# Altium schematic sheet MacroQMK.SchDoc
size A4; SheetNumber: 1; SheetTotal: 1
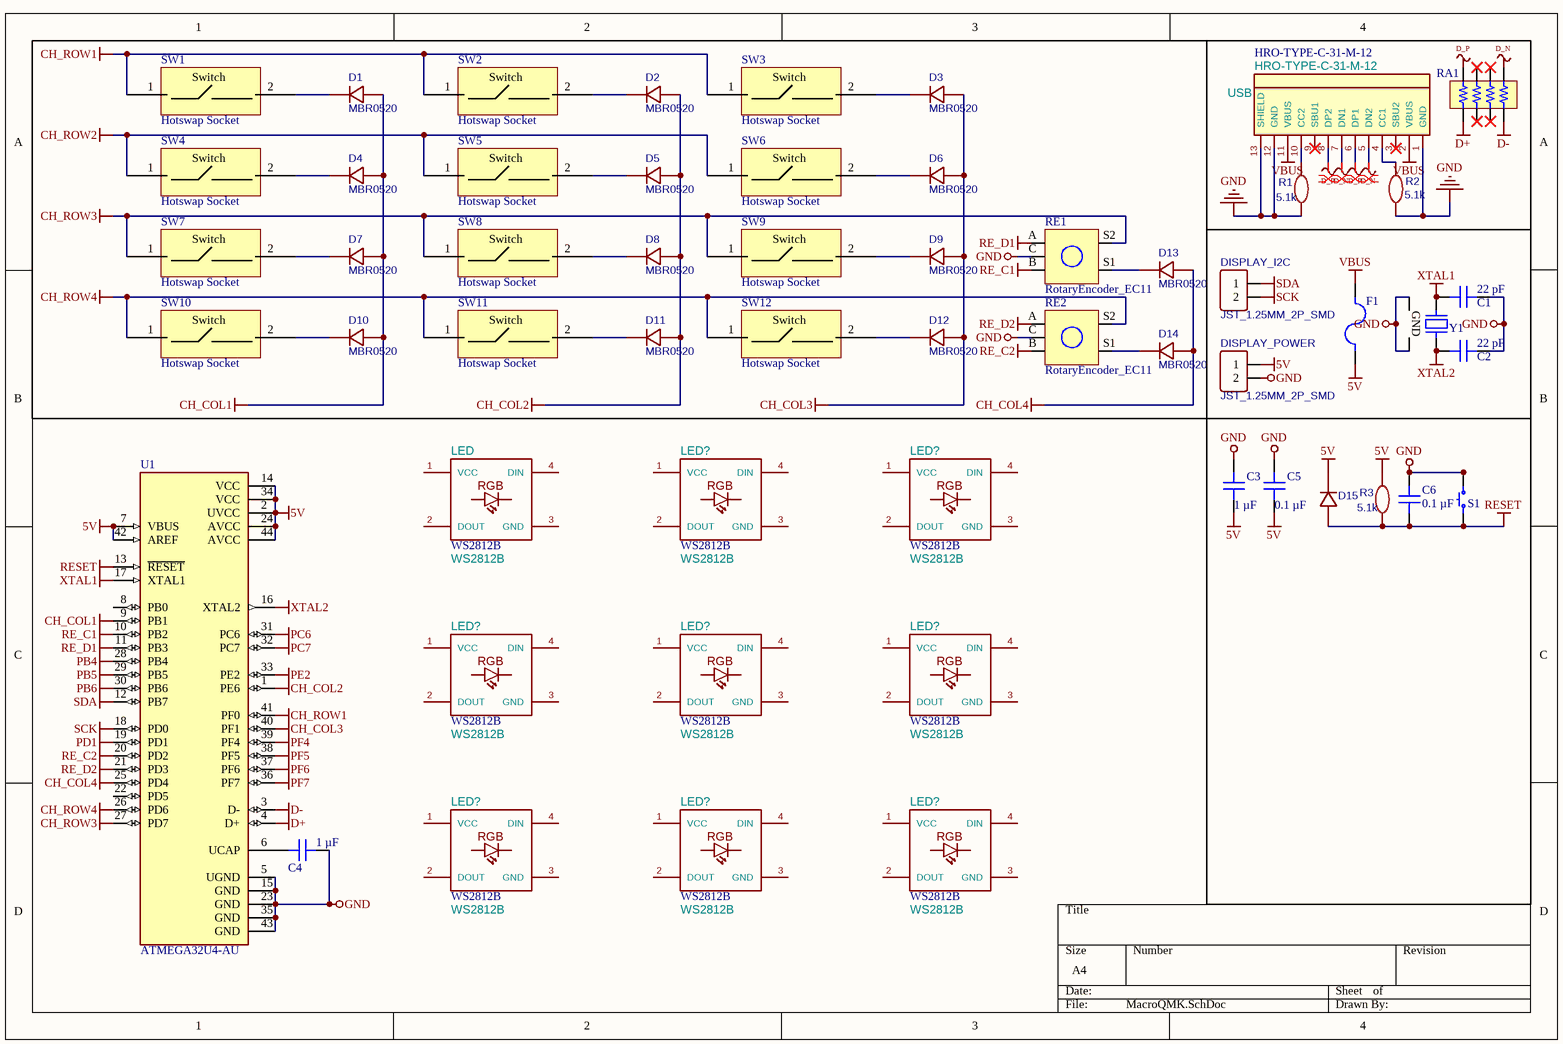
[diagram p0: MacroQMK.SchDoc]

## Parts
(Parts that share a designator on the sheet are numbered #1, #2 ... from top to bottom, then left to right.)
C1  22 pF  [CAP 0402_1005]
C2  22 pF  [CAP 0402_1005]
C3  1 µF  [CAP 0402_1005]
C4  1 µF  [CAP 0402_1005]
C5  0.1 µF  [CAP 0402_1005]
C6  0.1 µF  [CAP 0402_1005]
D1  MBR0520  [SOD123F]
D2  MBR0520  [SOD123F]
D3  MBR0520  [SOD123F]
D4  MBR0520  [SOD123F]
D5  MBR0520  [SOD123F]
D6  MBR0520  [SOD123F]
D7  MBR0520  [SOD123F]
D8  MBR0520  [SOD123F]
D9  MBR0520  [SOD123F]
D10  MBR0520  [SOD123F]
D11  MBR0520  [SOD123F]
D12  MBR0520  [SOD123F]
D13  MBR0520  [SOD123F]
D14  MBR0520  [SOD123F]
D15  MBR0520  [SOD123F]  (value not drawn)
DISPLAY_I2C  JST_1.25MM_2P_SMD  [JST_1.25MM_2P_SMD]
DISPLAY_POWER  JST_1.25MM_2P_SMD  [JST_1.25MM_2P_SMD]
F1  MF-MSMF050/60-2  [FUSER_MF-MSMF020/60-2]  (value not drawn)
LED  WS2812B  [WS2812B]
LED?#1  WS2812B  [WS2812B]
LED?#2  WS2812B  [WS2812B]
LED?#3  WS2812B  [WS2812B]
LED?#4  WS2812B  [WS2812B]
LED?#5  WS2812B  [WS2812B]
LED?#6  WS2812B  [WS2812B]
LED?#7  WS2812B  [WS2812B]
LED?#8  WS2812B  [WS2812B]
R1  5.1k  [RES 0402_1005]
R2  5.1k  [RES 0402_1005]
R3  5.1k  [RES 0402_1005]
RA1  741C083220JP  [RESNET 0804-8 CONCAVE]  (value not drawn)
RE1  RotaryEncoder_EC11  [RotaryEncoder_EC11]
RE2  RotaryEncoder_EC11  [RotaryEncoder_EC11]
S1  EVQ-Q2Y03W  [PANASONIC EVQQ2]  (value not drawn)
SW1  Hotswap Socket  [MX-Hotswap-Template]
SW2  Hotswap Socket  [MX-Hotswap-Template]
SW3  Hotswap Socket  [MX-Hotswap-Template]
SW4  Hotswap Socket  [MX-Hotswap-Template]
SW5  Hotswap Socket  [MX-Hotswap-Template]
SW6  Hotswap Socket  [MX-Hotswap-Template]
SW7  Hotswap Socket  [MX-Hotswap-Template]
SW8  Hotswap Socket  [MX-Hotswap-Template]
SW9  Hotswap Socket  [MX-Hotswap-Template]
SW10  Hotswap Socket  [MX-Hotswap-Template]
SW11  Hotswap Socket  [MX-Hotswap-Template]
SW12  Hotswap Socket  [MX-Hotswap-Template]
U1  ATMEGA32U4-AU  [QFP80P1200X1200X120-44N]
USB  HRO-TYPE-C-31-M-12  [HRO-TYPE-C-31-M-12]
Y1  16MHz  [NDK NX3225SA]  (value not drawn)

## Nets
5V: C3.1 C5.1 D15.1 DISPLAY_POWER.1 F1.1 R3.2 U1.2(UVCC) U1.7(VBUS) U1.14(VCC) U1.24(AVCC) U1.34(VCC) U1.42(AREF) U1.44(AVCC)
CH_COL1: D1.2 D4.2 D7.2 D10.2 U1.9(PB1)
CH_COL2: D2.2 D5.2 D8.2 D11.2 U1.1(PE6)
CH_COL3: D3.2 D6.2 D9.2 D12.2 U1.40(PF1)
CH_COL4: D13.2 D14.2 U1.25(PD4)
CH_ROW1: SW1.1 SW2.1 SW3.1 U1.41(PF0)
CH_ROW2: SW4.1 SW5.1 SW6.1
CH_ROW3: RE1.S2 SW7.1 SW8.1 SW9.1 U1.27(PD7)
CH_ROW4: RE2.S2 SW10.1 SW11.1 SW12.1 U1.26(PD6)
D+: RA1.1 U1.4(D+)
D-: RA1.4 U1.3(D-)
D_N: RA1.5 USB.5(DN2) USB.7(DN1)
D_P: RA1.8 USB.6(DP1) USB.8(DP2)
GND: C1.2 C2.2 C3.2 C4.2 C5.2 C6.2 DISPLAY_POWER.2 R1.1 R2.1 RE1.C RE2.C S1.3 S1.4 U1.5(UGND) U1.15(GND) U1.23(GND) U1.35(GND) U1.43(GND) USB.1(GND) USB.12(GND) USB.13(SHIELD) Y1.2(GND) Y1.4(GND)
PB4: U1.28(PB4)
PB5: U1.29(PB5)
PB6: U1.30(PB6)
PC6: U1.31(PC6)
PC7: U1.32(PC7)
PD1: U1.19(PD1)
PE2: U1.33(PE2)
PF4: U1.39(PF4)
PF5: U1.38(PF5)
PF6: U1.37(PF6)
PF7: U1.36(PF7)
RE_C1: RE1.B U1.10(PB2)
RE_C2: RE2.B U1.20(PD2)
RE_D1: RE1.A U1.11(PB3)
RE_D2: RE2.A U1.21(PD3)
RESET: C6.1 D15.2 R3.1 S1.1 S1.2 U1.13(~{RESET})
SCK: DISPLAY_I2C.2 U1.18(PD0)
SDA: DISPLAY_I2C.1 U1.12(PB7)
VBUS: F1.2 USB.2(VBUS) USB.11(VBUS)
XTAL1: C1.1 U1.17(XTAL1) Y1.1
XTAL2: C2.1 U1.16(XTAL2) Y1.3
NetC4_1: C4.1 U1.6(UCAP)
NetD1_1: D1.1 SW1.2
NetD2_1: D2.1 SW2.2
NetD3_1: D3.1 SW3.2
NetD4_1: D4.1 SW4.2
NetD5_1: D5.1 SW5.2
NetD6_1: D6.1 SW6.2
NetD7_1: D7.1 SW7.2
NetD8_1: D8.1 SW8.2
NetD9_1: D9.1 SW9.2
NetD10_1: D10.1 SW10.2
NetD11_1: D11.1 SW11.2
NetD12_1: D12.1 SW12.2
NetD13_1: D13.1 RE1.S1
NetD14_1: D14.1 RE2.S1
NetR1_2: R1.2 USB.10(CC2)
NetR2_2: R2.2 USB.4(CC1)

Not connected (* = marked no-connect by the designer): LED 1(VCC) 2(DOUT) 3(GND) 4(DIN); LED?#1 1(VCC) 2(DOUT) 3(GND) 4(DIN); LED?#2 1(VCC) 2(DOUT) 3(GND) 4(DIN); LED?#3 1(VCC) 2(DOUT) 3(GND) 4(DIN); LED?#4 1(VCC) 2(DOUT) 3(GND) 4(DIN); LED?#5 1(VCC) 2(DOUT) 3(GND) 4(DIN); LED?#6 1(VCC) 2(DOUT) 3(GND) 4(DIN); LED?#7 1(VCC) 2(DOUT) 3(GND) 4(DIN); LED?#8 1(VCC) 2(DOUT) 3(GND) 4(DIN); RA1 2* 3* 6* 7*; U1 8(PB0) 22(PD5); USB 3(SBU2)* 9(SBU1)*

## Layout directives
differential pair: D_N, D_P

## Notes on the sheet
- (in symbol MX_Cherry) Switch
- (in symbol WS2812B) RGB

## Library data of the parts
C1 C2 = CBR04C220J5GAC: CAP CER 22PF 50V C0G/NP0 0402; Manufacturer: KEMET; id: 14; Temperature Coefficient: C0G, NP0; Tolerance: ±5%; Part Number: CBR04C220J5GAC; Value: 22 pF; Supplier Part Number 1: 399-6174-1-ND; ComponentLink2Description: DigiKey Link; Features: High Q, Low Loss, Ultra Low ESR; ComponentLink1URL: https://api.kemet.com/component-edge/download/datasheet/CBR04C220J5GAC.pdf; PartId: 1726; Supplier 1: DigiKey; Series: CBR-SMD RF C0G; LastUpdated: 2023-01-03T20:04:20.640; Part Status: Active; Capacitance: 22 pF; Device Package: 0402 (1005 Metric); Thickness (Max): 0.022" (0.55mm); Voltage - Rated: 50V; Minimum Order: 1; Packaging: TapeAndReel; Applications: RF, Microwave, High Frequency; Package / Case: 0402 (1005 Metric); ComponentLink1Description: Datasheet; Price: 0.02; ComponentLink2URL: https://www.digikey.com/en/products/detail/kemet/CBR04C220J5GAC/2732293; Lifecycle Status: Active; Operating Temperature: -55°C ~ 125°C; Size / Dimension: 0.039" L x 0.020" W (1.00mm x 0.50mm); Mounting Type: Surface Mount, MLCC
C3 C4 = GRM155C71A105KE11D: CAP CER 1UF 10V X7S 0402; Manufacturer: Murata Electronics; id: 27; Tolerance: ±10%; Part Number: GRM155C71A105KE11D; Value: 1 µF; Temperature Coefficient: X7S; Supplier Part Number 1: 490-14457-1-ND; ComponentLink2Description: DigiKey Link; ComponentLink1URL: https://search.murata.co.jp/Ceramy/image/img/A01X/G101/ENG/GRM155C71A105KE11-01.pdf; PartId: 1749; Supplier 1: DigiKey; Series: GRM; LastUpdated: 2023-01-03T20:04:20.473; Part Status: Active; Capacitance: 1 µF; Device Package: 0402 (1005 Metric); Thickness (Max): 0.024" (0.60mm); Voltage - Rated: 10V; Minimum Order: 1; Packaging: TapeAndReel; Applications: General Purpose; Package / Case: 0402 (1005 Metric); ComponentLink1Description: Datasheet; Price: 0.01; ComponentLink2URL: https://www.digikey.com/en/products/detail/murata-electronics/GRM155C71A105KE11D/6606086; Lifecycle Status: Active; Operating Temperature: -55°C ~ 125°C; Size / Dimension: 0.039" L x 0.020" W (1.00mm x 0.50mm); Mounting Type: Surface Mount, MLCC
C5 C6 = CL05B104KP5VPNC: CAP CER 100NF 10V X7R 0402; Manufacturer: Samsung Electro-Mechanics; id: 7736; Tolerance: ±10%; Part Number: CL05B104KP5VPNC; Value: 0.1 µF; Temperature Coefficient: X7R; Supplier Part Number 1: 1276-CL05B104KP5VPNCCT-ND; ComponentLink2Description: DigiKey Link; ComponentLink1URL: https://mm.digikey.com/Volume0/opasdata/d220001/medias/docus/5458/CL05B104KP5VPNC_Spec.pdf; PartId: 56690; Supplier 1: DigiKey; Series: CL; LastUpdated: 2023-11-05T20:02:55.743; Capacitance: 0.1 µF; Device Package: 0402 (1005 Metric); Ratings: AEC-Q200; Thickness (Max): 0.022" (0.55mm); Voltage - Rated: 10V; Minimum Order: 1; Packaging: TapeAndReel; Applications: Automotive; Package / Case: 0402 (1005 Metric); ComponentLink1Description: Datasheet; Price: 0.01; ComponentLink2URL: https://www.digikey.com/en/products/detail/samsung-electro-mechanics/CL05B104KP5VPNC/20498482; Lifecycle Status: Active; Operating Temperature: -55°C ~ 125°C; Size / Dimension: 0.039" L x 0.020" W (1.00mm x 0.50mm); Mounting Type: Surface Mount, MLCC
D1-D15 = 1N4007W: BOM_Manufacturer: BLUE ROCKET; Contributor: LCEDA_Lib; BOM_Supplier: LCSC; BOM_Supplier Part: C328592; BOM_Manufacturer Part: 1N4007W; spicePre: D; spiceSymbolName: 1N4007W
DISPLAY_I2C DISPLAY_POWER = JST_1.25MM_2P_SMD: Contributor: LCEDA_Lib; Package Display: No; BOM_Supplier Part: C49661; BOM_Supplier: LCSC; spicePre: H; spiceSymbolName: HDR-F-2.54_1x2
F1 = MF-MSMF020/60-2: Polymeric PTC Resettable Fuse 60V 500mA Ih Surface Mount 1812 (4532 Metric), Concave; MF: Bourns; Purchase-URL: https://pricing.snapeda.com/search/part/MF-MSMF020/60-2/?ref=eda; Value: *; Package: 1812 Bourns; Check_prices: https://www.snapeda.com/parts/MF-MSMF020/60-2/Bourns/view-part/?ref=eda; Price: None; Availability: In Stock; MP: MF-MSMF020/60-2; SnapEDA_Link: https://www.snapeda.com/parts/MF-MSMF020/60-2/Bourns/view-part/?ref=snap
R1-R3 = 4.7k: nameAlias: Value(Ω); Contributor: LCEDA_Lib; spicePre: R; spiceSymbolName: R_0603_EU
RA1 = 741C083220JP: RES ARRAY 4 RES 22 OHM 0804; Manufacturer: CTS Resistor Products; id: 1038; Temperature Coefficient: ±200ppm/°C; Resistance (Ohms): 22; Number Of Resistors: 4; Circuit Type: Isolated; Tolerance: ±5%; Power Per Element: 63mW; Part Number: 741C083220JP; Height - Seated (Max): 0.020" (0.50mm); Supplier Part Number 1: 741C083220JPCT-ND; ComponentLink1Description: Datasheet; ComponentLink2URL: https://www.digikey.com/en/products/detail/cts-resistor-products/741C083220JP/1124480; ComponentLink1URL: https://www.ctscorp.com/wp-content/uploads/74x.pdf; Supplier 1: DigiKey; Series: 741; Part Status: Active; ComponentLink2Description: DigiKey Link; Number Of Pins: 8; Packaging: TapeAndReel; Minimum Order: 1; Applications: Automotive AEC-Q200, DDR SDRAM, DRAM, MDDR; Package / Case: 0804, Concave, Long Side Terminals; PartId: 1038; Lifecycle Status: Active; LastUpdated: 2023-01-02T21:00:50.070; Operating Temperature: -55°C ~ 125°C; Size / Dimension: 0.079" L x 0.039" W (2.00mm x 1.00mm); Mounting Type: Surface Mount; Price: 0.02
S1 = EVQ-Q2Y03W: SWITCH TACTILE SPST-NO 0.02A 15V; Manufacturer: Panasonic Electronic Components; id: 27; Switch Function: Off-Mom; Contact Rating @ Voltage: 0.02A @ 15VDC; Outline: 6.50mm x 6.00mm; Actuator Height Off Pcb, Vertical: 3.10mm; Actuator Orientation: Top Actuated; Actuator Type: Standard; Illumination: Non-Illuminated; Operating Force: 350gf; Part Number: EVQ-Q2Y03W; Supplier Part Number 1: P12961SCT-ND; ComponentLink1Description: Datasheet; ComponentLink2URL: http://digikey.com/product-detail/en/panasonic-electronic-components/EVQ-Q2Y03W/P12961SCT-ND/762951; ComponentLink1URL: https://industrial.panasonic.com/ac/cdn/e/control/switch/light-touch/catalog/sw_lt_eng_6s_th.pdf; Supplier 1: DigiKey; Series: EVQQ2; Part Status: Active; ComponentLink2Description: DigiKey Link; Packaging: TapeAndReel; Minimum Order: 1; Lifecycle Status: Active; LastUpdated: 2020-04-09T09:55:12.503; Termination Style: J Lead; Operating Temperature: -40°C ~ 85°C; Circuit: SPST-NO; Mounting Type: Surface Mount; Price: 0.16
SW1-SW12 = MX_Cherry
U1 = ATMEGA32U4-AU: AVR AVRÂ® ATmega Microcontroller IC 8-Bit 16MHz 32KB (16K x 16) FLASH 44-TQFP (10x10); MF: Microchip Technology; Value: *; Purchase-URL: https://pricing.snapeda.com/search/part/ATMEGA32U4-AU/?ref=eda; Availability: In Stock; Price: None; Package: TQFP-44 Microchip; MP: ATMEGA32U4-AU
Y1 = NX3225SA-16MHZ-STD-CSR-6: CRYSTAL 16.0000MHZ 8PF SMD; Manufacturer: NDK America, Inc.; id: 577; Frequency Tolerance: ±15ppm; Frequency Stability: ±25ppm; Operating Mode: Fundamental; Esr (Equivalent Series Resistance): 80 Ohms; Part Number: NX3225SA-16MHZ-STD-CSR-6; Height - Seated (Max): 0.024" (0.60mm); Supplier Part Number 1: 644-1182-1-ND; ComponentLink1Description: Datasheet; ComponentLink2URL: http://digikey.com/product-detail/en/ndk-america-inc/NX3225SA-16MHZ-STD-CSR-6/644-1182-1-ND/3125571; ComponentLink1URL: http://www.ndk.com/images/products/catalog/c_NX3225SA_e.pdf; Supplier 1: DigiKey; Frequency: 16MHz; Series: NX3225SA; Part Status: Active; Type: MHz Crystal; ComponentLink2Description: DigiKey Link; Packaging: TapeAndReel; Minimum Order: 1; Package / Case: 4-SMD, No Lead; PartId: 577; Lifecycle Status: Active; LastUpdated: 2023-01-02T20:58:24.833; Operating Temperature: -40°C ~ 85°C; Value: 16MHz; Size / Dimension: 0.126" L x 0.098" W (3.20mm x 2.50mm); Mounting Type: Surface Mount; Price: 0.45; Load Capacitance: 8pF
LED LED?#1-LED?#8 = WS2812B: Value: WS2812B
USB = HRO-TYPE-C-31-M-12: Value: HRO-TYPE-C-31-M-12